# Altium schematic sheet OPA4377四路 V2.0.SchDoc
size A4
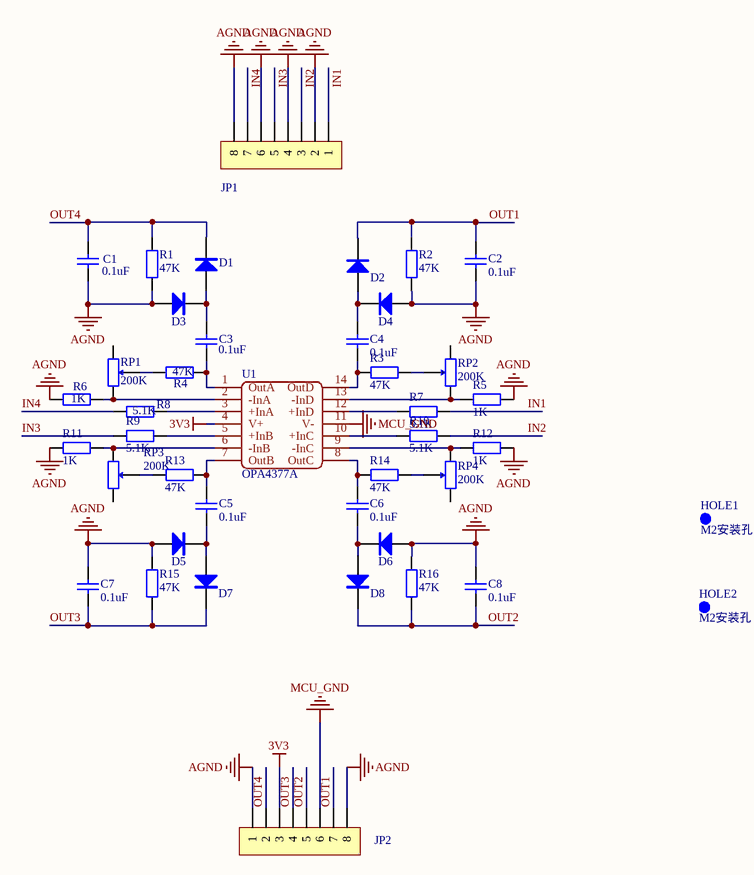
[diagram p0: OPA4377四路 V2.0.SchDoc]

## Parts
C1  0.1uF  [C0603_M]
C2  0.1uF  [C0603_M]
C3  0.1uF  [C0603_M]
C4  0.1uF  [C0603_M]
C5  0.1uF  [C0603_M]
C6  0.1uF  [C0603_M]
C7  0.1uF  [C0603_M]
C8  0.1uF  [C0603_M]
D1  1N5819W  [SOD-123]  (value not drawn)
D2  1N5819W  [SOD-123]  (value not drawn)
D3  1N5819W  [SOD-123]  (value not drawn)
D4  1N5819W  [SOD-123]  (value not drawn)
D5  1N5819W  [SOD-123]  (value not drawn)
D6  1N5819W  [SOD-123]  (value not drawn)
D7  1N5819W  [SOD-123]  (value not drawn)
D8  1N5819W  [SOD-123]  (value not drawn)
HOLE1  M2安装孔  [M2安装孔]
HOLE2  M2安装孔  [M2安装孔]
JP1  FPC1.0-8P  [FPC0.5 2H-WS-8P]  (value not drawn)
JP2  FPC1.0-8P  [FPC0.5 2H-WS-8P]  (value not drawn)
R1  47K  [R0603_M]
R2  47K  [R0603_M]
R3  47K  [R0603_M]
R4  47K  [R0603_M]
R5  1K  [R0603_M]
R6  1K  [R0603_M]
R7  5.1K  [R0603_M]
R8  5.1K  [R0603_M]
R9  5.1K  [R0603_M]
R10  5.1K  [R0603_M]
R11  1K  [R0603_M]
R12  1K  [R0603_M]
R13  47K  [R0603_M]
R14  47K  [R0603_M]
R15  47K  [R0603_M]
R16  47K  [R0603_M]
RP1  200K  [3362P]
RP2  200K  [3362P]
RP3  200K  [3362P]
RP4  200K  [3362P]
U1  OPA4377A  [TSSOP14_M]

## Nets
3V3: JP2.3 U1.4(V+)
AGND: C1.1 C2.1 C7.1 C8.1 D3.1(A) D4.1(A) D5.1(A) D6.1(A) JP1.2 JP1.4 JP1.6 JP1.8 JP2.1 JP2.8 R1.1 R2.1 R5.1 R6.1 R11.1 R12.1 R15.1 R16.1
MCU_GND: JP2.6 U1.11(V-)
IN1: JP1.1 R7.1
IN2: JP1.3 R10.1
IN3: JP1.5 R9.1
IN4: JP1.7 R8.1
OUT1: C2.2 D2.2(K) JP2.7 R2.2
OUT2: C8.2 D8.2(K) JP2.5 R16.2
OUT3: C7.2 D7.2(K) JP2.4 R15.2
OUT4: C1.2 D1.2(K) JP2.2 R1.2
NetC3_1: C3.1 R4.2 U1.1(OutA)
NetC3_2: C3.2 D1.1(A) D3.2(K)
NetC4_1: C4.1 R3.2 U1.14(OutD)
NetC4_2: C4.2 D2.1(A) D4.2(K)
NetC5_1: C5.1 R13.2 U1.7(OutB)
NetC5_2: C5.2 D5.2(K) D7.1(A)
NetC6_1: C6.1 R14.2 U1.8(OutC)
NetC6_2: C6.2 D6.2(K) D8.1(A)
NetR3_1: R3.1 RP2.2
NetR4_1: R4.1 RP1.2
NetR5_2: R5.2 RP2.3 U1.13(-InD)
NetR6_2: R6.2 RP1.3 U1.2(-InA)
NetR7_2: R7.2 U1.12(+InD)
NetR8_2: R8.2 U1.3(+InA)
NetR9_2: R9.2 U1.5(+InB)
NetR10_2: R10.2 U1.10(+InC)
NetR11_2: R11.2 RP3.3 U1.6(-InB)
NetR12_2: R12.2 RP4.3 U1.9(-InC)
NetR13_1: R13.1 RP3.2
NetR14_1: R14.1 RP4.2

Not connected (* = marked no-connect by the designer): RP1 1; RP2 1; RP3 1; RP4 1

## Library data of the parts
C1-C8 = C: 贴片电容; BOM名称: 无极性贴片电容; 联系卖家，免费查找封装: 唯一出售店铺网址https://shop463601444.taobao.com; 封装库来自淘宝卖家ID：黄晶宝石: 其他店铺购入均为盗版假冒封装库，请立即申请退款
D1-D8 = 1N5822: 肖特基二极管; 联系卖家，免费查找封装: 唯一出售店铺网址https://shop463601444.taobao.com; BOM名称: 肖特基二极管
JP1 JP2 = FPC-8P: FPC连接器; 版权归属: 源创客; BOM名称: FPC连接器; 学习资源: www.ooocke.com
R1-R16 = R: 贴片电阻; 联系卖家，免费查找封装: 唯一出售店铺网址https://shop463601444.taobao.com; 封装库来自淘宝卖家ID：黄晶宝石: 其他店铺购入均为盗版假冒封装库，请立即申请退款; BOM名称: 贴片电阻
RP1-RP4 = RP: 单联电位器; BOM名称: 插件电位器; 联系卖家，免费查找封装: 唯一出售店铺网址https://shop463601444.taobao.com; 封装库来自淘宝卖家ID：黄晶宝石: 其他店铺购入均为盗版假冒封装库，请立即申请退款
U1 = OPA4377A: OPA4377S四路运放芯片